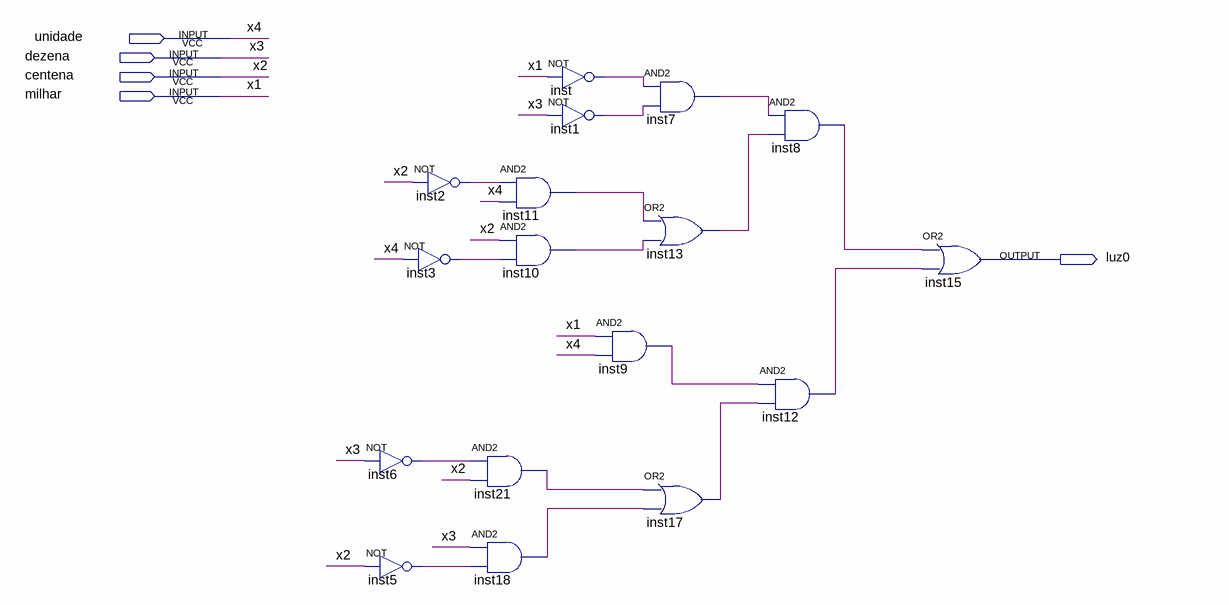
[diagram p0: schematic sheet]
// Quartus schematic luz0.bdf as structural Verilog: 17 symbols, 5 pins
module luz0 (
  input  unidade,
  input  dezena,
  input  centena,
  input  milhar,
  output luz0
);

  wire inst1_out, inst2_out, inst3_out, inst5_out, inst6_out, inst7_out, inst8_out, inst9_out, inst10_out,
       inst11_out, inst12_out, inst13_out, inst17_out, inst18_out, inst21_out, inst_out;

  not inst6 (inst6_out, dezena);
  not inst5 (inst5_out, centena);
  not inst2 (inst2_out, centena);
  not inst3 (inst3_out, unidade);
  and inst11 (inst11_out, inst2_out, unidade);
  and inst10 (inst10_out, centena, inst3_out);
  and inst21 (inst21_out, inst6_out, centena);
  and inst18 (inst18_out, dezena, inst5_out);
  not inst (inst_out, milhar);
  not inst1 (inst1_out, dezena);
  and inst9 (inst9_out, milhar, unidade);
  and inst7 (inst7_out, inst_out, inst1_out);
  or inst13 (inst13_out, inst11_out, inst10_out);
  or inst17 (inst17_out, inst21_out, inst18_out);
  and inst8 (inst8_out, inst7_out, inst13_out);
  and inst12 (inst12_out, inst9_out, inst17_out);
  or inst15 (luz0, inst8_out, inst12_out);

  // Other names for the same wires on the sheet: x1 = milhar; x2 = centena; x3 = dezena; x4 = unidade
endmodule
